# Altium schematic sheet 45 Pin Connectors.SchDoc
size A4; SheetNumber: 9; SheetTotal: 9
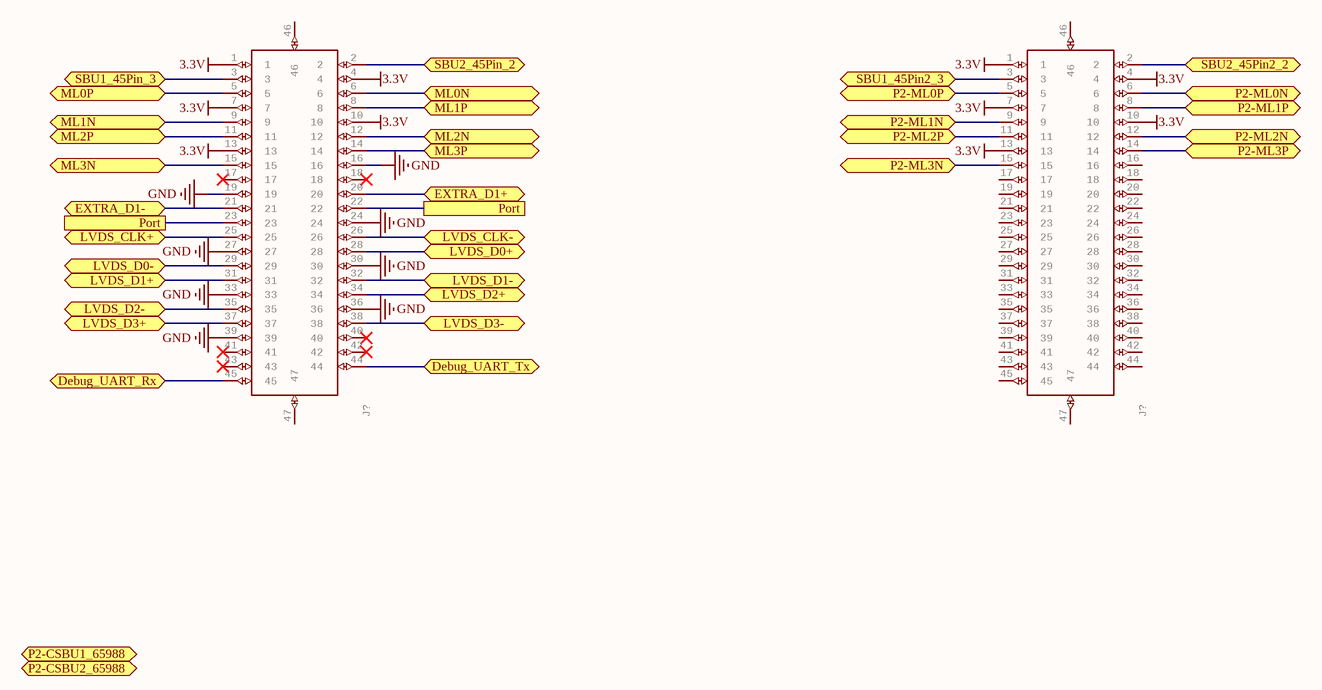
[diagram p0: 45 Pin Connectors.SchDoc]

## Parts
(Parts that share a designator on the sheet are numbered #1, #2 ... from top to bottom, then left to right.)
J?#1  AMP - TE CONNECTIVITY - 4-2328724-5 - CONNECTOR, FPC, R/A, 45POS, 1ROW, 0.3MM   Source:  Datasheet  [423287245]  (value not drawn)
J?#2  AMP - TE CONNECTIVITY - 4-2328724-5 - CONNECTOR, FPC, R/A, 45POS, 1ROW, 0.3MM   Source:  Datasheet  [423287245]  (value not drawn)

## Ports
Debug_UART_Rx (bidir), Debug_UART_Tx (bidir), EXTRA_D1+ (bidir), EXTRA_D1- (bidir), LVDS_CLK+ (bidir), LVDS_CLK- (bidir), LVDS_D0+ (bidir), LVDS_D0- (bidir), LVDS_D1+ (bidir), LVDS_D1- (bidir), LVDS_D2+ (bidir), LVDS_D2- (bidir), LVDS_D3+ (bidir), LVDS_D3- (bidir), ML0N (bidir), ML0P (bidir), ML1N (bidir), ML1P (bidir), ML2N (bidir), ML2P (bidir), ML3N (bidir), ML3P (bidir), P2-CSBU1_65988 (bidir), P2-CSBU2_65988 (bidir), P2-ML0N (bidir), P2-ML0P (bidir), P2-ML1N (bidir), P2-ML1P (bidir), P2-ML2N (bidir), P2-ML2P (bidir), P2-ML3N (bidir), P2-ML3P (bidir), Port, SBU1_45Pin2_3 (bidir), SBU1_45Pin_3 (bidir), SBU2_45Pin2_2 (bidir), SBU2_45Pin_2 (bidir)

## Nets
3.3V: J?#1.1 J?#1.4 J?#1.7 J?#1.10 J?#1.13 J?#2.1 J?#2.4 J?#2.7 J?#2.10 J?#2.13
GND: J?#1.16 J?#1.19 J?#1.24 J?#1.27 J?#1.30 J?#1.33 J?#1.36 J?#1.39
Debug_UART_Rx: J?#1.45 ; port Debug_UART_Rx
Debug_UART_Tx: J?#1.44 ; port Debug_UART_Tx
EXTRA_D1+: J?#1.20 ; port EXTRA_D1+
EXTRA_D1-: J?#1.21 ; port EXTRA_D1-
LVDS_CLK+: J?#1.25 ; port LVDS_CLK+
LVDS_CLK-: J?#1.26 ; port LVDS_CLK-
LVDS_D0+: J?#1.28 ; port LVDS_D0+
LVDS_D0-: J?#1.29 ; port LVDS_D0-
LVDS_D1+: J?#1.31 ; port LVDS_D1+
LVDS_D1-: J?#1.32 ; port LVDS_D1-
LVDS_D2+: J?#1.34 ; port LVDS_D2+
LVDS_D2-: J?#1.35 ; port LVDS_D2-
LVDS_D3+: J?#1.37 ; port LVDS_D3+
LVDS_D3-: J?#1.38 ; port LVDS_D3-
ML0N: J?#1.6 ; port ML0N
ML0P: J?#1.5 ; port ML0P
ML1N: J?#1.9 ; port ML1N
ML1P: J?#1.8 ; port ML1P
ML2N: J?#1.12 ; port ML2N
ML2P: J?#1.11 ; port ML2P
ML3N: J?#1.15 ; port ML3N
ML3P: J?#1.14 ; port ML3P
P2-ML0N: J?#2.6 ; port P2-ML0N
P2-ML0P: J?#2.5 ; port P2-ML0P
P2-ML1N: J?#2.9 ; port P2-ML1N
P2-ML1P: J?#2.8 ; port P2-ML1P
P2-ML2N: J?#2.12 ; port P2-ML2N
P2-ML2P: J?#2.11 ; port P2-ML2P
P2-ML3N: J?#2.15 ; port P2-ML3N
P2-ML3P: J?#2.14 ; port P2-ML3P
Port: J?#1.22 J?#1.23 ; port Port
SBU1_45Pin2_3: J?#2.3 ; port SBU1_45Pin2_3
SBU1_45Pin_3: J?#1.3 ; port SBU1_45Pin_3
SBU2_45Pin2_2: J?#2.2 ; port SBU2_45Pin2_2
SBU2_45Pin_2: J?#1.2 ; port SBU2_45Pin_2

Not connected (* = marked no-connect by the designer): J?#1 17* 18* 40* 41* 42* 43* 46 47; J?#2 16 17 18 19 20 21 22 23 24 25 26 27 28 29 30 31 32 33 34 35 36 37 38 39 40 41 42 43 44 45 46 47

## Library data of the parts
J?#1 J?#2 = 4-2328724-5: GateName_1: G$1; SymbolName_1: 4-2328724-5; LibraryName: 4-2328724-5; DeviceSetName: 4-2328724-5; Package: 423287245; Manufacturer_Name: TE Connectivity; Manufacturer_Part_Number: 4-2328724-5; Mouser_Part_Number: 571-4-2328724-5; Mouser_Price-Stock: https://www.mouser.co.uk/ProductDetail/TE-Connectivity/4-2328724-5?qs=w%2Fv1CP2dgqow3y3efq3sig%3D%3D; Arrow_Part_Number: 4-2328724-5; Arrow_Price-Stock: https://www.arrow.com/en/products/4-2328724-5/te-connectivity; Height: 1.1mm